# EAGLE design Udoo_Shield (EAGLE 7.5.0)
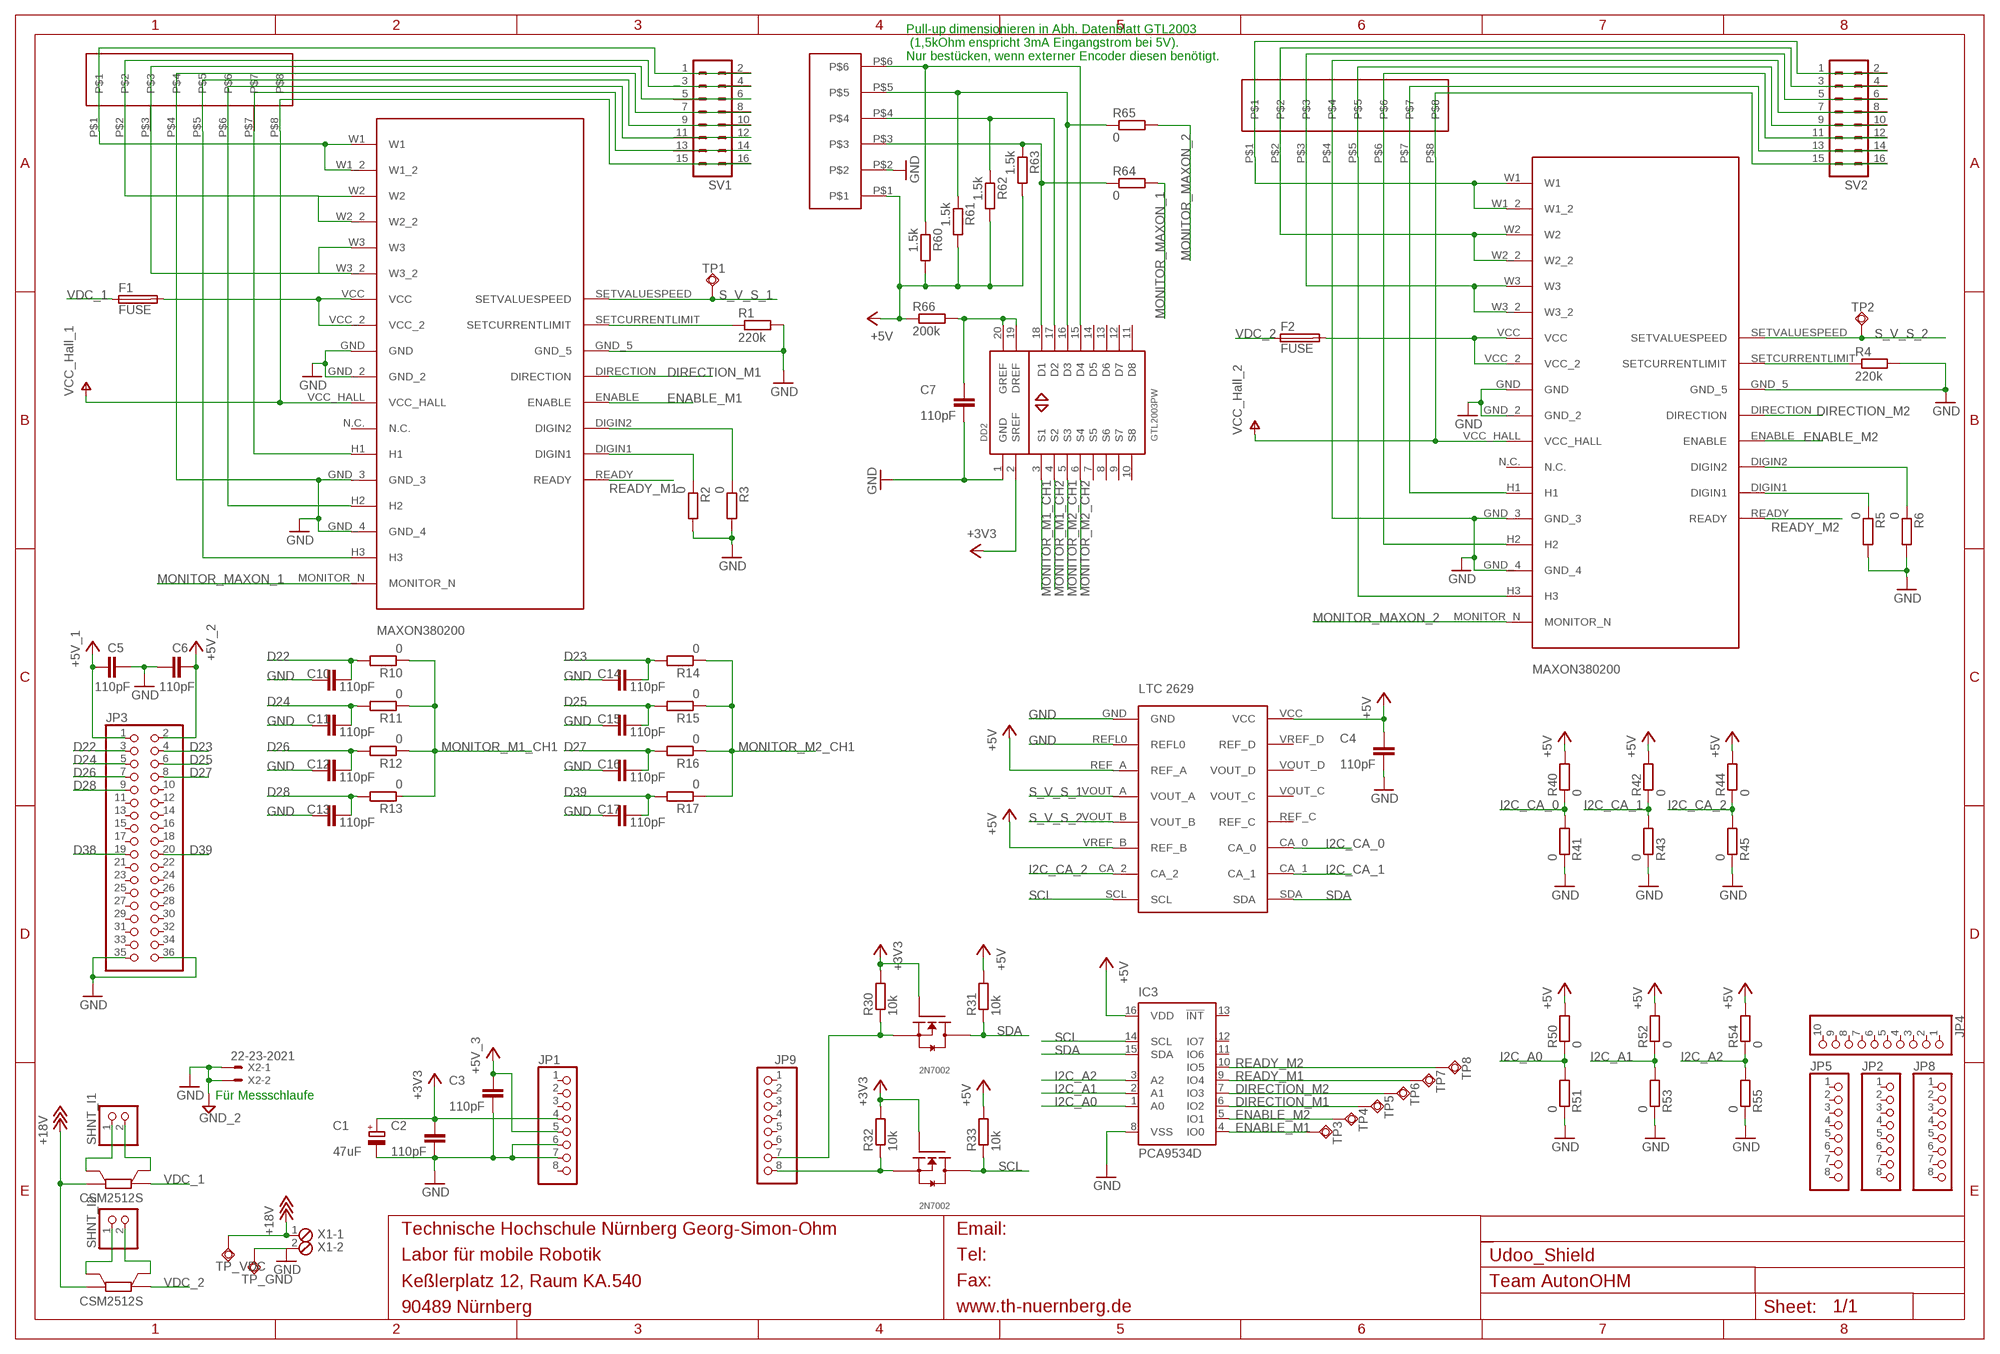
[diagram p0: schematic, sheet 1]

## Parts
C1  47uF  PANASONI_F_FP  [PANASONIC_F]
C2  110pF  C-EU0805  [SMD-0805]
C3  110pF  C-EU0805  [SMD-0805]
C4  110pF  C-EU0805  [SMD-0805]
C5  110pF  C-EU0805  [SMD-0805]
C6  110pF  C-EU0805  [SMD-0805]
C7  110pF  C-EU0805  [SMD-0805]
C10  110pF  C-EU0805  [SMD-0805]
C11  110pF  C-EU0805  [SMD-0805]
C12  110pF  C-EU0805  [SMD-0805]
C13  110pF  C-EU0805  [SMD-0805]
C14  110pF  C-EU0805  [SMD-0805]
C15  110pF  C-EU0805  [SMD-0805]
C16  110pF  C-EU0805  [SMD-0805]
C17  110pF  C-EU0805  [SMD-0805]
DD2  GTL2003PW  [TSSOP20]
ENCODER  WAGO_PICOMAX_35_6POLIG  [WAGO_PICOMAX_35_6POLIG]
F1  FUSE  [FUSE]
F2  FUSE  [FUSE]
FRAME1  A3L-LOC  [A3L-LOC]
IC3  PCA9534D  [SO16W]
JP1  PINHD-1X8  [1X08]
JP2  PINHD-1X8  [1X08]
JP3  PINHD-2X18  [2X18]
JP4  PINHD-1X10  [1X10]
JP5  PINHD-1X8  [1X08]
JP8  PINHD-1X8  [1X08]
JP9  PINHD-1X8  [1X08]
R1  220k  R-EU_M1206  [M1206]
R2  0  R-EU_M0805  [M0805]
R3  0  R-EU_M0805  [M0805]
R4  220k  R-EU_M1206  [M1206]
R5  0  R-EU_M0805  [M0805]
R6  0  R-EU_M0805  [M0805]
R10  0  R-EU_M0805  [M0805]
R11  0  R-EU_M0805  [M0805]
R12  0  R-EU_M0805  [M0805]
R13  0  R-EU_M0805  [M0805]
R14  0  R-EU_M0805  [M0805]
R15  0  R-EU_M0805  [M0805]
R16  0  R-EU_M0805  [M0805]
R17  0  R-EU_M0805  [M0805]
R30  10k  R-EU_M0805  [M0805]
R31  10k  R-EU_M0805  [M0805]
R32  10k  R-EU_M0805  [M0805]
R33  10k  R-EU_M0805  [M0805]
R40  0  R-EU_M0805  [M0805]
R41  0  R-EU_M0805  [M0805]
R42  0  R-EU_M0805  [M0805]
R43  0  R-EU_M0805  [M0805]
R44  0  R-EU_M0805  [M0805]
R45  0  R-EU_M0805  [M0805]
R50  0  R-EU_M0805  [M0805]
R51  0  R-EU_M0805  [M0805]
R52  0  R-EU_M0805  [M0805]
R53  0  R-EU_M0805  [M0805]
R54  0  R-EU_M0805  [M0805]
R55  0  R-EU_M0805  [M0805]
R60  1.5k  R-EU_M0805  [M0805]
R61  1.5k  R-EU_M0805  [M0805]
R62  1.5k  R-EU_M0805  [M0805]
R63  1.5k  R-EU_M0805  [M0805]
R64  0  R-EU_M0805  [M0805]
R65  0  R-EU_M0805  [M0805]
R66  200k  R-EU_M0805  [M0805]
SHNT_I1  PINHD-1X2  [1X02]
SHNT_I2  PINHD-1X2  [1X02]
SV1  MA08-2  [MA08-2]
SV2  MA08-2  [MA08-2]
TP1  TPSQB1,27  [B1,27]
TP2  TPSQB1,27  [B1,27]
TP3  TPSQB1,27  [B1,27]
TP4  TPSQB1,27  [B1,27]
TP5  TPSQB1,27  [B1,27]
TP6  TPSQB1,27  [B1,27]
TP7  TPSQB1,27  [B1,27]
TP8  TPSQB1,27  [B1,27]
TP_GND  TPSQB1,27  [B1,27]
TP_VDC  TPSQB1,27  [B1,27]
U$1  MAXON380200  [380200]
U$2  MAXON380200  [380200]
U$3  WAGO_PICOMAX_35_8POLIG  [WAGO_PICOMAX_35_8POLIG]
U$4  WAGO_PICOMAX_35_8POLIG  [WAGO_PICOMAX_35_8POLIG]
U$5  LTC2629  [LTC2629]
U$6  N-CH_MOSFET_2N7002  [2N7002]
U$10  CSM2512S  [CSM2512S]
U$14  CSM2512S  [CSM2512S]
U$15  N-CH_MOSFET_2N7002  [2N7002]
X1  MPT2  [2POL254]
X2  22-23-2021  [22-23-2021]

## Nets
+3V3: C1.+ C2.1 DD2.2(SREF) JP1.4 R30.2 R32.2 U$6.GATE(G) U$15.GATE(G)
+5V: C3.1 C4.1 C5.1 C6.2 ENCODER.P$1 IC3.16(VDD) JP1.5 JP3.1 JP3.2 R31.2 R33.2 R40.2 R42.2 R44.2 R50.2 R52.2 R54.2 R60.2 R61.2 R62.2 R63.2 R66.1 U$5.REF_A U$5.VCC U$5.VREF_B(REF_B) ; supply symbol labelled +5V_1, +5V_3, +5V_2
+18V: TP_VDC.TP U$10.I_2 U$14.I_2 X1.1
D1: JP9.8 R32.1 U$6.SOURCE(S)
D22: C10.2 JP3.3 R10.2
D23: C14.2 JP3.4 R14.2
D24: C11.2 JP3.5 R11.2
D25: C15.2 JP3.6 R15.2
D26: C12.2 JP3.7 R12.2
D27: C16.2 JP3.8 R16.2
D28: C13.2 JP3.9 R13.2
D34: JP9.7 R30.1 U$15.SOURCE(S)
D38: JP3.19
D39: C17.2 JP3.20 R17.2
DIRECTION_M1: IC3.6(IO2) TP5.TP U$1.DIRECTION
DIRECTION_M2: IC3.7(IO3) TP6.TP U$2.DIRECTION
ENABLE_M1: IC3.4(IO0) TP3.TP U$1.ENABLE
ENABLE_M2: IC3.5(IO1) TP4.TP U$2.ENABLE
GND: C1.- C2.2 C3.2 C4.2 C5.2 C6.1 C7.2 C10.1 C11.1 C12.1 C13.1 C14.1 C15.1 C16.1 C17.1 DD2.1(GND) ENCODER.P$2 IC3.8(VSS) JP1.6 JP1.7 JP3.35 JP3.36 R1.2 R2.2 R3.2 R4.2 R5.2 R6.2 R41.1 R43.1 R45.1 R51.1 R53.1 R55.1 SV1.7 SV1.8 SV2.7 SV2.8 TP_GND.TP U$1.GND U$1.GND_2 U$1.GND_3 U$1.GND_4 U$1.GND_5 U$2.GND U$2.GND_2 U$2.GND_3 U$2.GND_4 U$2.GND_5 U$3.P$4 U$4.P$4 U$5.GND U$5.REFL0 X1.2 X2.1 X2.2 ; supply symbol labelled GND_2
I2C_A0: IC3.1(A0) R50.1 R51.2
I2C_A1: IC3.2(A1) R52.1 R53.2
I2C_A2: IC3.3(A2) R54.1 R55.2
I2C_CA_0: R40.1 R41.2 U$5.CA_0
I2C_CA_1: R42.1 R43.2 U$5.CA_1
I2C_CA_2: R44.1 R45.2 U$5.CA_2
MONITOR_M1_CH1: DD2.3(S1) R10.1 R11.1 R12.1 R13.1
MONITOR_M1_CH2: DD2.4(S2)
MONITOR_M2_CH1: DD2.5(S3) R14.1 R15.1 R16.1 R17.1
MONITOR_M2_CH2: DD2.6(S4)
MONITOR_MAXON_1: R64.2 U$1.MONITOR_N
MONITOR_MAXON_2: R65.2 U$2.MONITOR_N
N$1: SV2.1 SV2.2 U$2.W1 U$2.W1_2 U$3.P$1
N$2: SV2.3 SV2.4 U$2.W2 U$2.W2_2 U$3.P$2
N$3: SV2.5 SV2.6 U$2.W3 U$2.W3_2 U$3.P$3
N$4: F1.P$2 U$1.VCC U$1.VCC_2
N$5: SHNT_I2.1 U$14.E_2
N$6: R1.1 U$1.SETCURRENTLIMIT
N$7: SV2.13 SV2.14 U$2.H1 U$3.P$7
N$8: SV1.13 SV1.14 U$1.H1 U$4.P$7
N$9: SV2.11 SV2.12 U$2.H2 U$3.P$6
N$10: SV2.9 SV2.10 U$2.H3 U$3.P$5
N$12: F2.P$2 U$2.VCC U$2.VCC_2
N$13: R4.1 U$2.SETCURRENTLIMIT
N$15: SV1.11 SV1.12 U$1.H2 U$4.P$6
N$16: SV1.9 SV1.10 U$1.H3 U$4.P$5
N$17: SV1.1 SV1.2 U$1.W1 U$1.W1_2 U$4.P$1
N$18: SHNT_I1.1 U$10.E_2
N$19: SHNT_I1.2 U$10.E_1
N$20: SHNT_I2.2 U$14.E_1
N$22: C7.1 DD2.19(DREF) DD2.20(GREF) R66.2
N$23: DD2.18(D1) ENCODER.P$3 R63.1 R64.1
N$24: DD2.17(D2) ENCODER.P$4 R62.1
N$25: DD2.16(D3) ENCODER.P$5 R61.1 R65.1
N$31: R5.1 U$2.DIGIN1
N$32: DD2.15(D4) ENCODER.P$6 R60.1
N$33: SV1.5 SV1.6 U$1.W3 U$1.W3_2 U$4.P$3
N$34: R6.1 U$2.DIGIN2
N$36: SV1.3 SV1.4 U$1.W2 U$1.W2_2 U$4.P$2
N$38: R2.1 U$1.DIGIN1
N$39: R3.1 U$1.DIGIN2
READY_M1: IC3.9(IO4) TP7.TP U$1.READY
READY_M2: IC3.10(IO5) TP8.TP U$2.READY
S_V_S_1: TP1.TP U$1.SETVALUESPEED U$5.VOUT_A
S_V_S_2: TP2.TP U$2.SETVALUESPEED U$5.VOUT_B
SCL: IC3.14(SCL) R33.1 U$5.SCL U$6.DRAIN(D)
SDA: IC3.15(SDA) R31.1 U$5.SDA U$15.DRAIN(D)
V_HALL_1: SV1.15 SV1.16 U$1.VCC_HALL U$4.P$8 ; supply symbol labelled VCC_Hall_1
V_HALL_2: SV2.15 SV2.16 U$2.VCC_HALL U$3.P$8 ; supply symbol labelled VCC_Hall_2
VDC_1: F1.P$1 U$10.I_1
VDC_2: F2.P$1 U$14.I_1
Unconnected: DD2.7(S5) DD2.8(S6) DD2.9(S7) DD2.10(S8) DD2.11(D8) DD2.12(D7) DD2.13(D6) DD2.14(D5) IC3.11(IO6) IC3.12(IO7) IC3.13(!INT) JP1.1 JP1.2 JP1.3 JP1.8 JP2.1 JP2.2 JP2.3 JP2.4 JP2.5 JP2.6 JP2.7 JP2.8 JP3.10 JP3.11 JP3.12 JP3.13 JP3.14 JP3.15 JP3.16 JP3.17 JP3.18 JP3.21 JP3.22 JP3.23 JP3.24 JP3.25 JP3.26 JP3.27 JP3.28 JP3.29 JP3.30 JP3.31 JP3.32 JP3.33 JP3.34 JP4.1 JP4.2 JP4.3 JP4.4 JP4.5 JP4.6 JP4.7 JP4.8 JP4.9 JP4.10 JP5.1 JP5.2 JP5.3 JP5.4 JP5.5 JP5.6 JP5.7 JP5.8 JP8.1 JP8.2 JP8.3 JP8.4 JP8.5 JP8.6 JP8.7 JP8.8 JP9.1 JP9.2 JP9.3 JP9.4 JP9.5 JP9.6 U$1.N.C. U$2.N.C. U$5.REF_C U$5.VOUT_C U$5.VOUT_D U$5.VREF_D(REF_D)

## Notes on the sheet
- Pull-up dimensionieren in Abh. Datenblatt GTL2003
   (1,5kOhm enspricht 3mA Eingangstrom bei 5V).
  Nur bestücken, wenn externer Encoder diesen benötigt.
- Für Messschlaufe

## Library data of the parts
C1 = Electrolytic Capacitors FP:PANASONI_F_FP
C2-C7 C10-C17 = robotic - Kondenstatoren:C-EU: CAPACITOR, European symbol
DD2 = gtl2003:GTL2003: 8-bit bidirectional low voltage translator
ENCODER = robotic - Stecker:WAGO_PICOMAX_35_6POLIG
F1 F2 = fuse:FUSE
FRAME1 = robotic - Rahmen:A3L-LOC: RAHMEN Labor für mobile Robotik Rahmen fuer Schaltplan; AUTHOR: Team AutonOHM; EMAIL: stefan.may@th-nuernberg.de; PROJECT_NAME: MaxonShield; VERSION: Version 2.0
IC3 = micro-philips:PCA9534: 8-bit I2C-bus and SMBus low power I/O port with interrupt Source: www.nxp.com .. PCA9534_3.pdf; MPN: PCA9534DB; OC_FARNELL: 1408284; OC_NEWARK: 18M7513
JP1 JP2 JP5 JP8 JP9 = pinhead:PINHD-1X8: PIN HEADER
JP3 = pinhead:PINHD-2X18: PIN HEADER
JP4 = pinhead:PINHD-1X10: PIN HEADER
R1-R6 R10-R17 R30-R33 R40-R45 R50-R55 R60-R66 = resistor:R-EU_: RESISTOR, European symbol
SHNT_I1 SHNT_I2 = pinhead:PINHD-1X2: PIN HEADER
SV1 SV2 = robotic - Stiftleisten:MA08-2: PIN HEADER
TP1-TP8 TP_GND TP_VDC = testpad:TPSQ: Test pad
U$1 U$2 = Maxon:MAXON380200
U$3 U$4 = robotic - Stecker:WAGO_PICOMAX_35_8POLIG
U$5 = Digital Analog Converter:LTC2629
U$6 U$15 = Transistor:N-CH_MOSFET_2N7002
U$10 U$14 = Shunt:CSM2512S
X1 = con-phoenix-254:MPT2: PHOENIX CONNECTOR; OC_FARNELL: unknown; OC_NEWARK: unknown
X2 = con-molex:22-23-2021: .100" (2.54mm) Center Header - 2 Pin; MF: MOLEX; MPN: 22-23-2021; OC_FARNELL: 1462926; OC_NEWARK: 25C3832

## Board
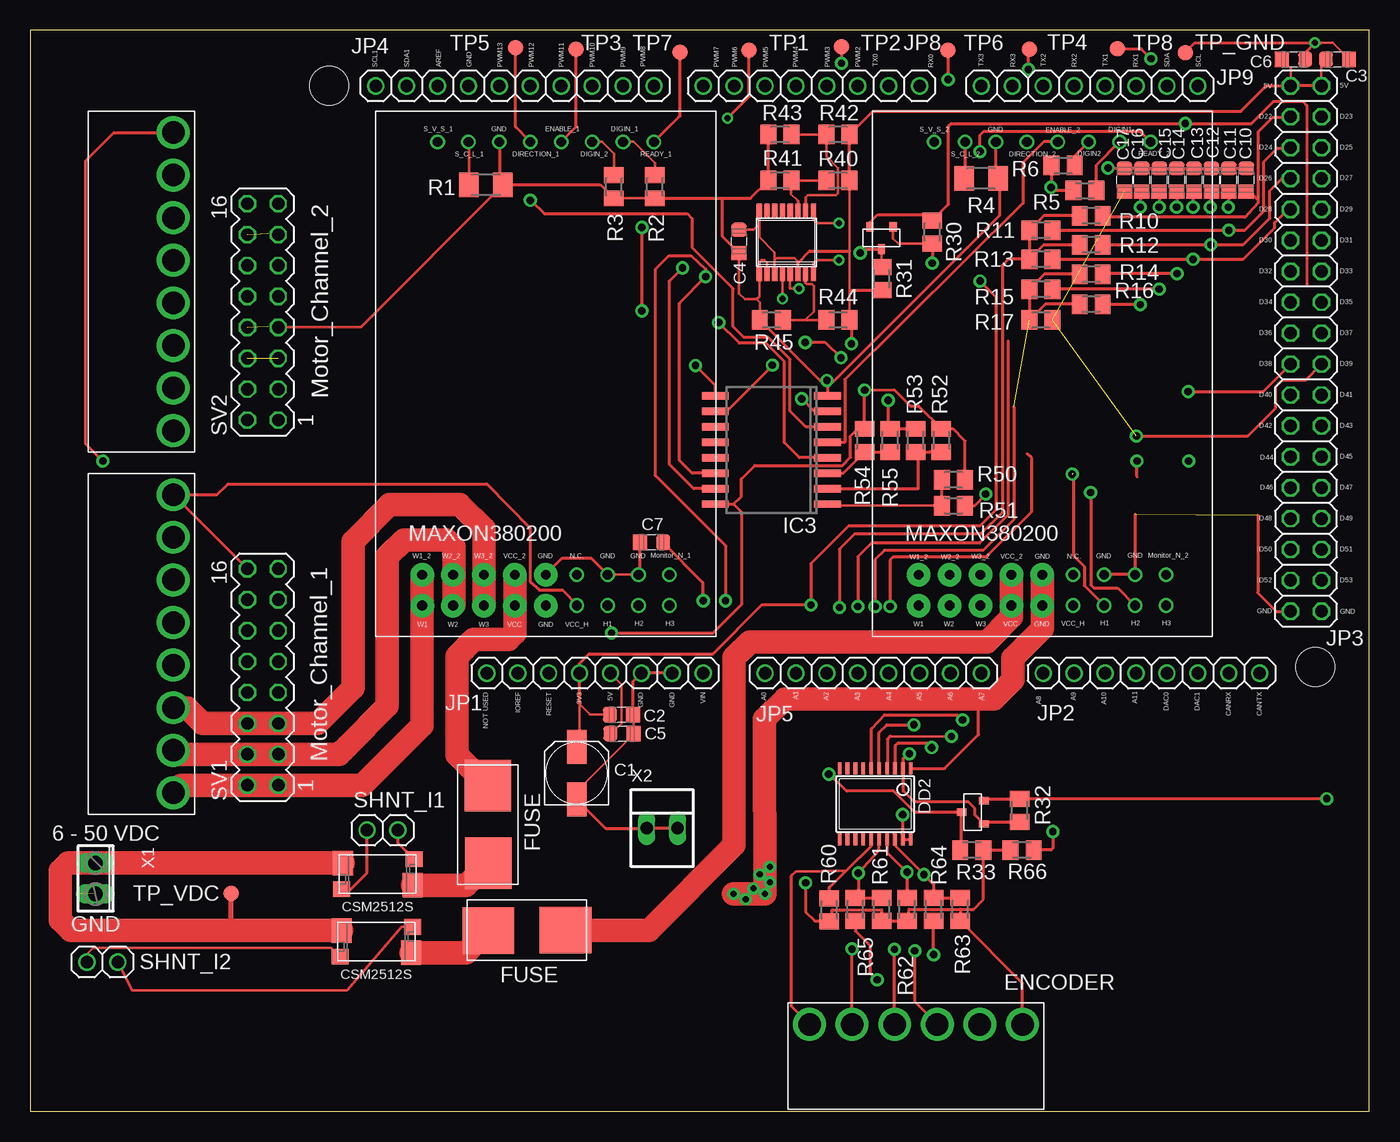
[diagram p1: board, top side]
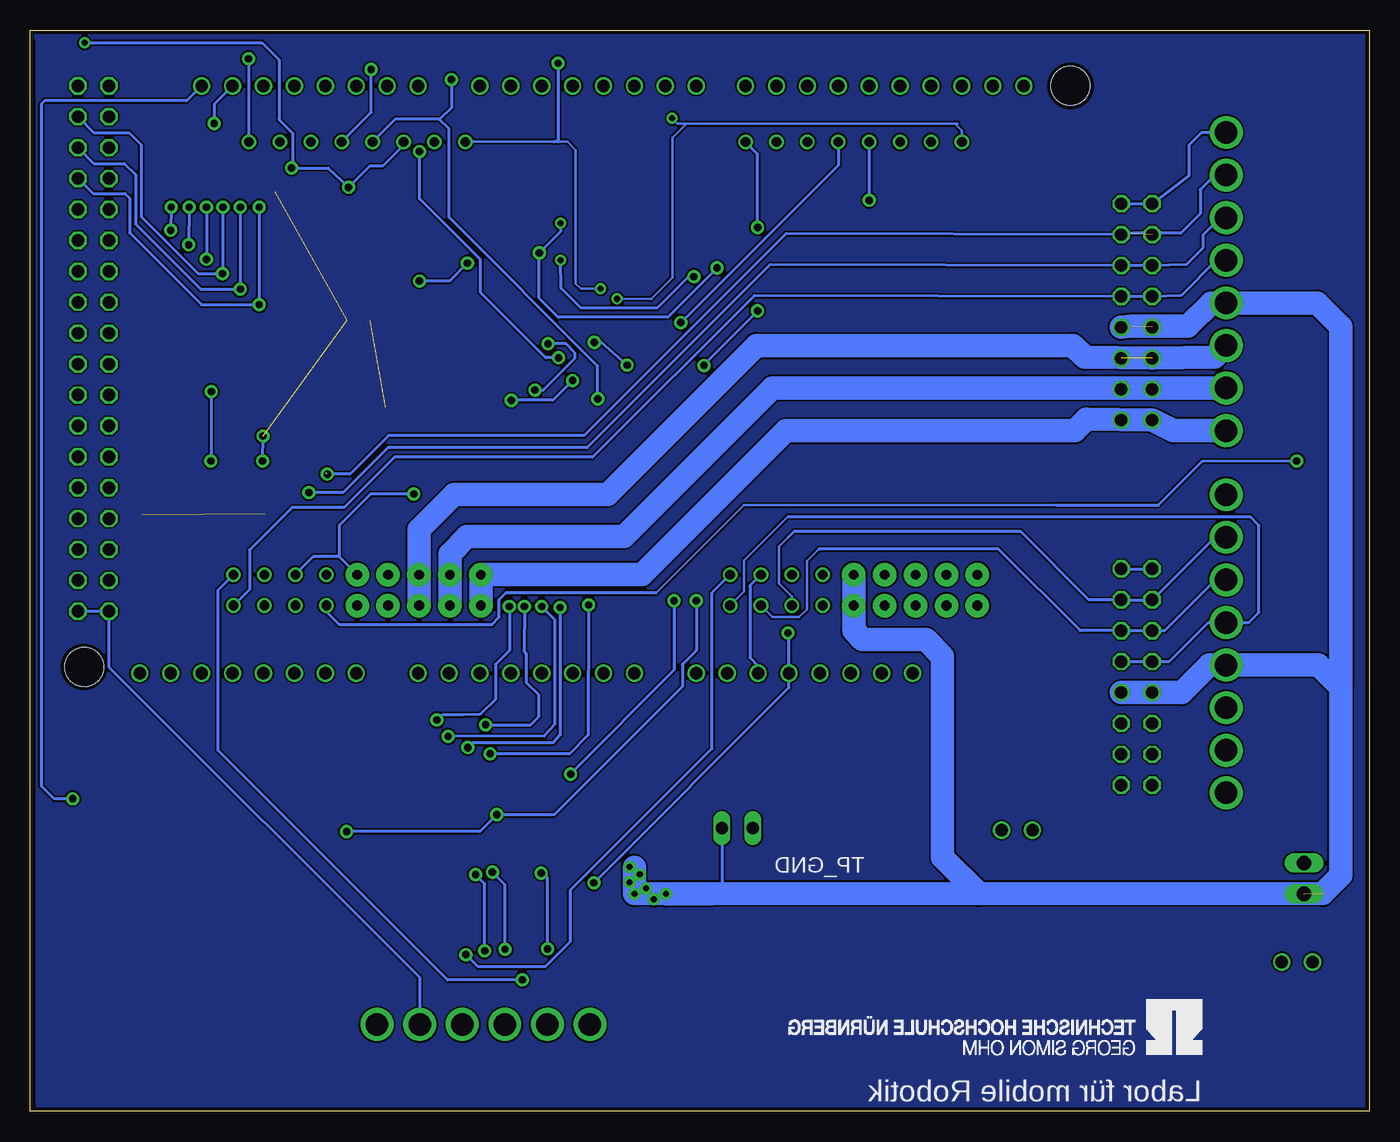
[diagram p2: board, bottom side, seen from below]

Size 109.99 x 88.8 mm. Coordinates in mm from the lower left corner, seen from the top.
Outline: 0,0 109.99,0 109.99,88.8 0,88.8 0,0
Copper layers (1*16): Top 0.035mm / dielectric 1.5mm / Bottom 0.035mm
Design rules "PCB-POOL Standard": minimum track width 0.15mm, minimum drill 0.3mm, track to track 0.15mm, track to pad 0.15mm, pad to pad 0.15mm, via to via 0.15mm, smd to smd 0.15mm, copper to edge 0.3mm, drill to drill 0.2mm, minimum pad ring 0.2mm, minimum via ring 0.15mm, stop-mask expansion 0.075mm, vias tented up to drill 0mil, thermal gap 0.2mm
Holes 3.2 mm at 24.53,84.25 105.58,36.49

### Footprints (pad centres in the part's own frame; a part is rotated, then mirrored left to right if it is on the bottom)
PANASONIC_F = smd 1.6 x 2.8: + 0,-2.143; - 0,2.143
SMD-0805 = smd 1.143 x 1.27: 1 -0.953,0; 2 0.953,0
TSSOP20 = smd 0.305 x 0.991: 1 -2.925,-2.918; 2 -2.275,-2.918; 3 -1.625,-2.918; 4 -0.975,-2.918; 5 -0.325,-2.918; 6 0.325,-2.918; 7 0.975,-2.918; 8 1.625,-2.918; 9 2.275,-2.918; 10 2.925,-2.918; 11 2.925,2.918; 12 2.275,2.918; 13 1.625,2.918; 14 0.975,2.918; 15 0.325,2.918; 16 -0.325,2.918; 17 -0.975,2.918; 18 -1.625,2.918; 19 -2.275,2.918; 20 -2.925,2.918
WAGO_PICOMAX_35_6POLIG = drill 1.85 pad 2.7: P$1 -22.38,1.75; P$2 -18.88,1.75; P$3 -15.38,1.75; P$4 -11.88,1.75; P$5 -8.38,1.75; P$6 -4.88,1.75
FUSE = smd 4.24 x 3.81: P$1 -3.175,-0.04; P$2 3.175,0
SO16W = smd 0.6 x 2.2: 1 -4.445,-4.6; 2 -3.175,-4.6; 3 -1.905,-4.6; 4 -0.635,-4.6; 5 0.635,-4.6; 6 1.905,-4.6; 7 3.175,-4.6; 8 4.445,-4.6; 9 4.445,4.6; 10 3.175,4.6; 11 1.905,4.6; 12 0.635,4.6; 13 -0.635,4.6; 14 -1.905,4.6; 15 -3.175,4.6; 16 -4.445,4.6
1X08 = drill 1.016: 1 -8.89,0; 2 -6.35,0; 3 -3.81,0; 4 -1.27,0; 5 1.27,0; 6 3.81,0; 7 6.35,0; 8 8.89,0
2X18 = drill 1.016 octagon: 1 -21.59,-1.27; 2 -21.59,1.27; 3 -19.05,-1.27; 4 -19.05,1.27; 5 -16.51,-1.27; 6 -16.51,1.27; 7 -13.97,-1.27; 8 -13.97,1.27; 9 -11.43,-1.27; 10 -11.43,1.27; 11 -8.89,-1.27; 12 -8.89,1.27; 13 -6.35,-1.27; 14 -6.35,1.27; 15 -3.81,-1.27; 16 -3.81,1.27; 17 -1.27,-1.27; 18 -1.27,1.27; 19 1.27,-1.27; 20 1.27,1.27; 21 3.81,-1.27; 22 3.81,1.27; 23 6.35,-1.27; 24 6.35,1.27; 25 8.89,-1.27; 26 8.89,1.27; 27 11.43,-1.27; 28 11.43,1.27; 29 13.97,-1.27; 30 13.97,1.27; 31 16.51,-1.27; 32 16.51,1.27; 33 19.05,-1.27; 34 19.05,1.27; 35 21.59,-1.27; 36 21.59,1.27
1X10 = drill 1.016: 1 -11.43,0; 2 -8.89,0; 3 -6.35,0; 4 -3.81,0; 5 -1.27,0; 6 1.27,0; 7 3.81,0; 8 6.35,0; 9 8.89,0; 10 11.43,0
M1206 = smd 1.6 x 2: 1 -1.4,0; 2 1.4,0
M0805 = smd 1.3 x 1.6: 1 -0.95,0; 2 0.95,0
1X02 = drill 1.016: 1 -1.27,0; 2 1.27,0
MA08-2 = drill 1.016 octagon: 1 -8.89,-1.27; 2 -8.89,1.27; 3 -6.35,-1.27; 4 -6.35,1.27; 5 -3.81,-1.27; 6 -3.81,1.27; 7 -1.27,-1.27; 8 -1.27,1.27; 9 1.27,-1.27; 10 1.27,1.27; 11 3.81,-1.27; 12 3.81,1.27; 13 6.35,-1.27; 14 6.35,1.27; 15 8.89,-1.27; 16 8.89,1.27
B1,27 = smd 1.27 x 1.27: TP 0,0
380200 = drill 0.8: DIGIN1 -6.35,-19.05; DIGIN2 -3.81,-19.05; DIRECTION 1.27,-19.05; ENABLE -1.27,-19.05; GND_3 -5.08,16.51; GND_4 -7.62,16.51; GND_5 3.81,-19.05; H1 -5.08,19.05; H2 -7.62,19.05; H3 -10.16,19.05; MONITOR_N -10.16,16.51; N.C. -2.54,16.51; READY -8.89,-19.05; SETCURRENTLIMIT 6.35,-19.05; SETVALUESPEED 8.89,-19.05; VCC_HALL -2.54,19.05 | drill 0.8 pad 1.93: GND 0,19.05; GND_2 0,16.51; VCC 2.54,19.05; VCC_2 2.54,16.51; W1 10.16,19.05; W1_2 10.16,16.51; W2 7.62,19.05; W2_2 7.62,16.51; W3 5.08,19.05; W3_2 5.08,16.51
WAGO_PICOMAX_35_8POLIG = drill 1.85 pad 2.7: P$1 1.75,1.75; P$2 5.25,1.75; P$3 8.75,1.75; P$4 12.25,1.75; P$5 15.75,1.75; P$6 19.25,1.75; P$7 22.75,1.75; P$8 26.25,1.75
LTC2629 = smd 0.42 x 1.143: CA_0 0.953,2.619; CA_1 1.587,2.619; CA_2 1.587,-2.619; GND -2.223,-2.619; REF_A -0.953,-2.619; REF_C 0.318,2.619; REFL0 -1.587,-2.619; SCL 2.223,-2.619; SDA 2.223,2.619; VCC -2.223,2.619; VOUT_A -0.318,-2.619; VOUT_B 0.318,-2.619; VOUT_C -0.318,2.619; VOUT_D -0.953,2.619; VREF_B 0.953,-2.619; VREF_D -1.587,2.619
2N7002 = smd 0.6 x 0.8: DRAIN 0,0.913; GATE -0.953,-0.913; SOURCE 0.953,-0.913
CSM2512S = smd 1.3 x 1.39: E_1 -1.23,2.977; E_2 1.23,-2.977 | smd 2.01 x 1.65: I_1 0.913,2.857; I_2 -0.913,-2.857
2POL254 = drill 1.2 long: 1 -1.27,0; 2 1.27,0
22-23-2021 = drill 1 long: 1 -1.27,0; 2 1.27,0

### Placement (x,y rotation side)
C1  44.88,27.77 180 top
C2  48.57,32.57 0 top
C3  107.39,86.43 0 top
C4  58.22,71.47 270 top
C5  48.61,31.03 0 top
C6  103.78,86.43 180 top
C7  51.03,46.74 180 top
C10  99.89,76.51 270 top
C11  98.46,76.51 270 top
C12  97.03,76.51 270 top
C13  95.6,76.51 270 top
C14  94.17,76.51 270 top
C15  92.75,76.51 270 top
C16  91.32,76.51 270 top
C17  89.89,76.51 270 top
DD2  69.41,25.23 180 top
ENCODER  59.13,8.88 180 top
F1  37.58,23.56 90 top
F2  40.8,14.87 0 top
FRAME1  70.02,-27.79 0 bottom  (outside the outline)
IC3  60.88,54.32 90 top
JP1  46.39,35.99 0 top
JP2  92.11,35.99 0 top
JP3  104.81,62.66 270 top
JP4  39.8,84.25 0 top
JP5  69.25,35.99 0 top
JP8  64.17,84.25 0 top
JP9  87.03,84.25 0 top
R1  37.42,76.11 0 top
R2  51.31,75.95 270 top
R3  47.94,75.95 270 top
R4  78.1,76.63 0 top
R5  86.63,75.63 180 top
R6  84.85,77.7 180 top
R10  87.15,73.57 0 top
R11  83.02,72.38 0 top
R12  87.15,71.19 0 top
R13  83.02,70 0 top
R14  87.15,68.77 0 top
R15  83.02,67.54 0 top
R16  87.15,66.31 0 top
R17  83.02,65 0 top
R30  74.09,72.22 270 top
R31  69.93,68.41 270 top
R32  81.28,24.71 270 top
R33  77.35,21.46 0 top
R40  66.35,76.47 0 top
R41  61.59,76.47 0 top
R42  66.35,80.24 0 top
R43  61.59,80.24 0 top
R44  66.35,65 0 top
R45  60.88,65 0 top
R50  75.84,51.86 0 top
R51  75.84,49.76 180 top
R52  74.85,55.12 90 top
R53  72.74,55.12 270 top
R54  68.54,55.12 90 top
R55  70.64,55.12 270 top
R60  65.64,16.54 270 top
R61  69.93,16.58 270 top
R62  72.03,16.58 270 top
R63  76.39,16.58 270 top
R64  74.21,16.58 270 top
R65  67.78,16.58 270 top
R66  81.47,21.46 0 top
SHNT_I1  28.93,23.09 0 top
SHNT_I2  5.91,12.25 0 top
SV1  19.09,35.67 90 top
SV2  19.09,65.67 90 top
TP1  59.05,87.18 0 top
TP2  66.63,87.46 0 top
TP3  44.84,87.26 0 top
TP4  82.07,87.26 0 top
TP5  39.84,87.38 0 top
TP6  75.4,87.18 0 top
TP7  53.38,87.02 0 top
TP8  89.29,87.3 0 top
TP_GND  94.89,86.98 0 top
TP_VDC  16.51,17.89 0 top
U$1  42.34,60.59 180 top
U$2  83.14,60.59 180 top
U$3  13.49,54.16 90 top
U$4  13.49,24.4 90 top
U$5  62.11,71.39 0 top
U$6  77.43,24.56 90 top
U$10  28.53,19.48 270 top
U$14  28.41,13.92 270 top
U$15  69.93,71.74 180 top
X1  5.35,19.12 270 top
X2  51.91,23.25 0 top

### Tracks (layer width: path | path; a pad name or v marks a point on that pad's centre or on a via)
+3V3  (via drill 0.6)
  Top 0.203: C2.1 45.99,32.57 45.12,33.45 45.12,30.15 C1.+ | U$15.GATE 70.88,71.7 71.31,71.27 R30.2
  Top 0.254: R32.2 78.5,23.77 U$6.GATE 77.58,24.36 77.58,24.87 77.07,25.39 72.62,25.39 71.71,26.3 71.71,28.12 DD2.2 71.69,28.97 v72.23,29.36 | R30.2 v74.09,69.68 | v78.02,68.21 79.33,66.9 79.33,49.4 78.02,48.09 67.23,48.09 64.13,45 v64.13,41.58 64.09,41.62 60.12,41.62 56.08,37.57 45.91,37.57 45.12,36.78 JP1.4 45.12,33.45
  Bottom 0.254: v64.13,41.58 64.17,30.91 65.68,29.36 v72.23,29.36 | v74.09,69.68 75.56,68.21 v78.02,68.21
+5V  (via drill 0.6)
  Top 0.203: U$5.VREF_B 63.06,69.8 62.78,70.08 61.35,70.08 61.16,69.88 | 61.16,69.88 U$5.REF_A | 67.31,66.58 67.3,66.59 67.3,67.02 | 67.31,66.58 R44.2 | U$5.VCC 59.89,72.89 | 59.89,72.89 59.89,71.82 61.16,70.55 61.16,69.88 | R40.2 67.31,70.67 67.31,67.42 67.31,66.58 | C5.1 47.66,30.95 48.57,31.86 48.57,35.07 JP1.5 | C3.1 106.08,86.07 JP3.2 | C6.2 103.54,85.71 JP3.1 | C4.1 59.41,72.42 59.89,72.89
  Top 0.254: R40.2 R42.2 69.21,82.14 99.45,82.14 101.56,84.25 JP3.1 JP3.2 | R44.2 67.47,64.84 v67.47,63.05 | 56.2,49.8 IC3.16 57.78,49.88 | R50.2 76.79,55.08 75.8,56.06 R52.2 72.98,57.93 72.31,57.93 70.96,59.28 v68.54,59.24 R54.2 67.98,56.06 67.39,55.47 67.39,53.73 66.71,53.05 59.53,53.05 58.42,51.94 58.42,50.51 57.78,49.88 | 76.39,16.58 72.19,16.58 72.19,15.79 R62.2 R61.2 69.93,16.55 65.88,16.55 65.88,15.83 R60.2 65.6,15.63 64.45,15.63 63.7,16.38 v63.7,18.76 | 76.39,16.58 R63.2 81.51,10.51 ENCODER.P$1 | R66.1 R33.2 78.3,17.41 77.51,16.58 76.39,16.58 | U$5.VREF_B 63.06,69.68 64.01,70.67 67.31,70.67 | R31.2 69.88,67.42 67.31,67.42 | v47.74,39.28 56.08,39.28 58.46,41.66 58.46,49.2 57.78,49.88
  Bottom 0.254: v63.7,18.76 47.66,34.8 JP1.5 47.66,39.2 v47.74,39.28 | v68.54,59.24 67.86,59.24 65.24,61.86 65.24,62.3 66,63.05 v67.47,63.05
+18V
  Top 0.254: U$14.I_2 25.55,14.91
  Top 0.406: TP_VDC.TP 16.47,17.89 16.47,14.83
  Top 1.93: U$10.I_2 X1.1 3.09,20.39 2.46,19.75 2.46,15.71 3.33,14.83 16.47,14.83 U$14.I_2
D1  (via drill 0.6)
  Top 0.254: U$6.SOURCE 78.5,25.66 R32.1 82.95,25.66 v106.52,25.67
  Bottom 0.254: JP9.8 97.15,83.02 108.82,83.02 109.1,82.74 109.1,26.74 108.03,25.67 v106.52,25.67
D22
  Top 0.254: 103.54,81.67 JP3.3 103.5,81.67 102.07,81.67 100.88,80.48 100.88,74.84 | 99.85,75.52 C10.2 100.17,75.55 100.88,74.84 | 100.88,74.84 100.88,74.64 99.81,73.45 88.22,73.45 R10.2
D23  (via drill 0.6)
  Top 0.254: C14.2 94.21,75.47 v94.17,74.28 | v94.21,68.81 88.1,68.81 R14.2
  Bottom 0.254: JP3.4 104.77,80.4 101.87,80.4 100.88,79.4 100.88,73.49 96.2,68.81 v94.21,68.81 v94.17,74.28
D24  (via drill 0.6)
  Top 0.254: R11.2 v98.46,72.38 99.77,72.38 101.36,73.97 101.36,78.02 102.47,79.13 103.5,79.13 JP3.5 103.54,79.13 | C11.2 v98.42,74.28
  Bottom 0.254: v98.42,74.28 v98.46,72.38
D25  (via drill 0.6)
  Top 0.254: C15.2 v92.75,74.28 | v92.75,67.54 R15.2
  Bottom 0.254: JP3.6 104.77,77.86 102.27,77.86 101.36,76.94 101.36,72.89 96,67.54 v92.75,67.54 v92.75,74.28
D26  (via drill 0.6)
  Top 0.254: R12.2 v96.99,71.19 99.65,71.19 101.83,73.37 101.83,75.63 102.79,76.59 103.5,76.59 JP3.7 103.54,76.51 | C12.2 96.99,75.52 v96.95,74.28
  Bottom 0.254: v96.95,74.28 v96.99,71.19
D27  (via drill 0.6)
  Top 0.254: C16.2 91.2,75.52 v91.2,74.28 | v91.2,66.27 88.1,66.27 R16.2
  Bottom 0.254: JP3.8 104.85,75.4 102.23,75.4 101.83,75 101.83,72.18 95.92,66.27 v91.2,66.27 v91.2,74.28
D28  (via drill 0.6)
  Top 0.254: R13.2 v95.52,70 99.65,70 102.23,72.58 102.23,73.01 103.3,74.09 JP3.9 103.54,74.2 | C13.2 95.52,75.52 v95.52,74.28
  Bottom 0.254: v95.52,74.28 v95.52,70
D34  (via drill 0.6)
  Top 0.254: 104.89,67.81 104.89,82.62 104.53,82.98 102.15,82.98 100.33,81.15 v94.89,81.15 75.68,81.15 75.44,80.91 75.44,74.52 R30.1 73.61,73.65 69.61,73.65 68.97,73.01 U$15.SOURCE
  Bottom 0.254: JP9.7 94.89,82.74 v94.89,81.15
D38  (via drill 0.6)
  Top 0.254: v95.13,59.12 101.28,59.12 JP3.19
  Bottom 0.254: v95.13,59.12 95.13,53.45 v95.17,53.41
D39  (via drill 0.6)  (2 unrouted)
  Top 0.254: 90.92,52.14 v90.92,53.41 | JP3.20 104.77,60.08 102.87,60.08 102.31,59.52 102.31,57.77 100.01,55.47 v90.88,55.47
  Bottom 0.254: v90.92,53.41 v90.88,55.47
DIRECTION_M1  (via drill 0.6)
  Top 0.254: U$1.DIRECTION 39.84,80.87 TP5.TP | IC3.6 63.73,56.23 62.43,57.54 62.43,61.78 60.6,63.61 58.58,63.61 57.74,64.44 57.74,67.58 54.37,70.95 54.37,73.33 53.97,73.73 42.22,73.73 41.11,74.84 v41.07,74.84
  Bottom 0.254: v41.07,74.84 U$1.DIRECTION | U$1.DIRECTION
DIRECTION_M2  (via drill 0.6)
  Top 0.254: TP6.TP v75.4,84.76 | IC3.7 64.41,57.5 v63.38,58.53
  Bottom 0.254: v75.4,84.76 75.4,82.46 76.36,81.51 76.39,81.51 | 76.39,81.51 80.01,81.51 U$2.DIRECTION | v63.38,58.53 63.38,61.23 75.6,73.45 75.6,80.71 76.39,81.51
ENABLE_M1  (via drill 0.6)
  Top 0.254: IC3.4 63.18,53.69 61.95,54.92 61.95,61.58 60.44,63.09 58.26,63.09 v56.55,64.8 | U$1.ENABLE 44.84,80.87 TP3.TP
  Bottom 0.254: v56.55,64.8 43.61,77.74 U$1.ENABLE
ENABLE_M2  (via drill 0.6)
  Top 0.254: U$2.ENABLE 83.26,79.64 81.55,77.94 81.55,74.6 66.91,60.12 66.91,54.96 IC3.5 | v81.99,85.59 81.99,87.26 TP4.TP
  Bottom 0.254: U$2.ENABLE 81.99,82.06 v81.99,85.59
GND  (via drill 0.5, 0.5 pad 1.02, 0.6)  (3 unrouted)
  Top 0.203: U$1.GND_3 U$1.GND_4 | 60.64,76.51 R41.1 | 59.65,66.7 58.69,66.7 58.22,67.18 C4.2 58.22,69.92 | 59.65,66.7 59.89,66.94 U$5.GND 59.89,69.72 60.08,69.92 60.32,69.92 60.52,69.72 U$5.REFL0 | R45.1 59.93,66.42 59.65,66.7 | 79.33,76.8 R4.2 | C2.2 49.57,32.73 C5.2 49.57,30.95 44.88,26.26 C1.- | C3.2 106.99,87.78 106.04,87.78 v105.52,87.78 | R3.2 R2.2 | U$1.GND_5
  Top 0.254: C10.1 C11.1 C12.1 C13.1 C14.1 C15.1 | C15.1 91.99,77.46 | C16.1 90.44,77.46 | 90.44,77.46 C17.1 89.89,77.5 v88.54,77.5 | 79.33,76.8 U$2.GND_5 | R6.2 83.9,75.95 v83.86,75.91 84.13,75.63 R5.2 | 90.44,77.46 90.52,77.54 91.91,77.54 91.99,77.46 | R2.2 56.87,75 | 56.87,75 59.18,75 R41.1 | 60.64,76.51 R43.1 | R1.2 46.83,76.11 R3.2 | C4.2 56.87,71.86 56.87,75 | R53.1 R55.1 70.48,56.22 v70.48,58.41 | 65.48,60 v65.44,60.04 64.89,60.04 R45.1 | JP1.7 JP1.6 49.53,35.31 C2.2 | 100.84,48.96 100.84,42.57 102.35,41.07 JP3.35 | 90.76,49.04 U$2.GND_4 U$2.GND_3 | U$1.GND_4 50.08,44.2 C7.2 | 65.48,60 66.04,60 79.65,73.61 79.65,76.48 R4.2 | 65.48,60 IC3.8 | v105.52,87.78 104.73,86.98 C6.1 | TP_GND.TP 95.68,87.78 106.04,87.78 | C1.- 47.26,23.25 X2.1 X2.2 | R51.1 77.58,49.76 v78.5,50.71 | U$1.GND_2 43.69,45.43 46.07,45.43 U$1.GND_3 | U$1.GND_5 38.53,76.4 R1.2 | SV2.7 27.19,64.48 R1.2 | DD2.1 75.11,28.15 77.9,30.95 77.9,33.68 78.1,33.88 | 91.99,77.46 C16.1 | C16.1 C15.1
  Top 0.406: v57.78,17.85 58.77,17.85 v58.77,17.41 | v59.41,18.29 60.36,18.29 | 60.36,18.29 v60.36,17.85 | 60.36,18.29 60.76,18.29 v60.76,18.8 | v59.92,19.44 60.76,19.44 v60.76,20.07 60.35,20.07 60.35,20.11
  Top 1.93: U$2.GND_2 U$2.GND 83.14,39.64 80.72,37.22 80.72,35.43 79.17,33.88 78.1,33.88 61.99,33.88 60.32,32.22 60.32,29.04 60.35,20.11 v60.36,17.85 v57.78,17.85
  Bottom 0.254: U$2.GND_5 79.33,79.36 81.04,77.66 82.11,77.66 v83.86,75.91 85.52,77.5 v88.54,77.5 88.46,77.7 88.46,80.36 89.57,81.47 89.57,86.39 90.96,87.78 v105.52,87.78 | v65.44,60.04 67.07,58.41 v70.48,58.41 | U$1.GND_4 50.88,43.17 50.88,37.26 50.2,36.58 JP1.6 | U$2.GND_2 84.61,45.55 | 84.61,45.55 86.75,45.55 U$2.GND_3 | ENCODER.P$2 78.01,10.97 103.54,36.5 JP3.35 JP3.36 | 84.61,45.55 84.61,48.13 82.03,50.71 v78.5,50.71 | 58.06,18.37 v57.78,17.85 | X2.2 53.18,18.76 54.09,17.85
  Bottom 0.406: U$2.GND
  Bottom 1.93: U$1.GND_2 U$1.GND 42.34,39.48 41.63,38.76 36.43,38.76 35.04,37.38 35.04,20.87 32.06,17.89 | 2.34,34.8 2.34,19.36 3.81,17.89 54.09,17.85 v57.78,17.85 60.36,17.89 60.36,20.03 | 2.34,34.8 4.19,36.65 U$4.P$4 13.15,36.65 15.39,34.4 SV1.8 SV1.7 | 2.34,34.8 2.34,64.48 4.27,66.41 U$3.P$4 12.97,66.41 14.88,64.5 19.54,64.5 SV2.7
GND_2
  pour Bottom: 0.23,88.53 109.61,88.53 109.61,88.17 109.45,88.17 109.45,0.35 0.23,0.35
I2C_A0
  Top 0.254: IC3.1 65.56,49.8 R51.2 R50.1
I2C_A1
  Top 0.254: IC3.2 72.94,51.15 72.94,53.97 R53.2 73.89,54.17 R52.1 75.4,54.17 75.48,54.08
I2C_A2
  Top 0.254: IC3.3 66.79,52.42 R54.1 R55.2
I2C_CA_0
  Top 0.203: R40.1 R41.2 62.5,76.47 62.5,75.36 63.06,74.8
  Top 0.254: 63.06,74.8 U$5.CA_0
I2C_CA_1
  Top 0.203: R43.2 R42.1 65.4,78.45 66.35,77.5 66.35,75.44 66.19,75.28 63.89,75.28 63.7,75.08
  Top 0.254: 63.7,75.08 U$5.CA_1
I2C_CA_2
  Top 0.203: 65.04,64.96 R44.1 63.73,65 | R45.2 63.73,65 | 63.73,65 63.7,65.04 64.37,65.71 64.37,67.78 64.21,67.93 63.81,67.93 63.7,68.05
  Top 0.254: 63.7,68.05 U$5.CA_2
MONITOR_M1_CH1  (via drill 0.6)
  Top 0.254: R13.1 R11.1 83.26,73.57 R10.1 | R13.1 83.26,71.19 R12.1 | R13.1 80.36,70 79.85,69.48 79.85,49.2 78.06,47.42 67.7,47.42 66.47,46.19 v66.47,41.38 | DD2.3 71.04,29.99 71.31,30.27 73.66,30.27 v74.05,29.87
  Bottom 0.254: v66.47,41.38 66.47,30.91 67.03,30.27 73.66,30.27 v74.05,29.87
MONITOR_M1_CH2  (via drill 0.6)
  Top 0.254: 80.32,63.29 80.32,48.96 77.98,46.66 69.09,46.66 67.98,45.55 v67.98,41.46 | DD2.4 70.39,28.64 70.4,28.66 70.4,30.55 70.68,30.83 v75.68,30.79
  Bottom 0.254: v67.98,41.46 66.91,40.39 66.91,31.78 67.78,30.83 v75.68,30.79
MONITOR_M2_CH1  (via drill 0.6)  (1 unrouted)
  Top 0.254: 80.8,57.85 80.8,48.61 78.26,46.07 70.16,46.07 69.41,45.31 v69.41,41.46 | DD2.5 69.73,31.11 70.36,31.74 v72.58,31.74 | R14.1 83.3,68.77 R15.1 R17.1 83.38,66.31 R16.1
  Bottom 0.254: v69.41,41.46 69.45,37.81 69.25,37.61 69.25,35.23 68.26,34.24 68.26,32.37 68.89,31.74 v72.58,31.74
MONITOR_M2_CH2  (via drill 0.6)
  Top 0.254: 81.91,54 82.23,53.68 82.23,49.24 78.5,45.51 70.88,45.51 70.64,45.27 v70.64,41.46 | DD2.6 69.08,31.42 70.16,32.57 76.16,32.57 v76.59,32.14
  Bottom 0.254: v70.64,41.46 70.64,37.85 71.79,36.7 71.79,33.84 73.06,32.61 74.41,32.57 76.16,32.57 v76.59,32.14
MONITOR_MAXON_1  (via drill 0.6)
  Top 0.254: v74.21,12.85 R64.2
  Bottom 0.254: v74.21,12.85 73.22,11.86 67.7,11.86 65.64,13.92 65.64,18.13 53.97,29.8 53.97,42.61 U$1.MONITOR_N
MONITOR_MAXON_2  (via drill 0.6)
  Top 0.254: R65.2 67.78,14.79 68.97,13.6 68.97,11.38 v69.57,10.78
  Bottom 0.254: v69.57,10.78 75.72,10.78 94.57,29.64 94.57,42.81 U$2.MONITOR_N
N$1
  Bottom 0.254: SV2.2 SV2.1
  Bottom 1.93: U$2.W1 U$2.W1_2 59.73,44.08 47.9,55.91 24.16,55.91 23.21,56.86 SV2.2 16.07,55.91 U$3.P$1
N$2
  Bottom 0.254: U$3.P$2 18.32,59.41 18.37,59.36 17.86,59.36 SV2.4 SV2.3
  Bottom 1.93: U$2.W2 U$2.W2_2 75.52,45.79 74.09,47.22 61.23,47.22 49.04,59.41 U$3.P$2
N$3  (1 unrouted)
  Bottom 1.93: U$2.W3 U$2.W3_2 78.06,47.77 75.16,50.67 62.58,50.67 50.34,62.91 24.34,62.91 23.37,61.94 SV2.6 12.71,61.94 U$3.P$3
N$4
  Top 1.93: U$1.VCC_2 U$1.VCC 39.8,39.28 39.29,38.76 36.43,38.76 35.04,37.38 35.04,29.28 F1.P$2
N$5
  Top 0.203: U$14.E_2 24.72,13.4 5.16,13.4 4.64,12.89 SHNT_I2.1
N$6
  Top 0.203: U$1.SETCURRENTLIMIT 36.02,79.61 R1.1
N$7  (via drill 0.6 pad 0.25)  (2 unrouted)
  Top 0.254: 85.68,52.42 85.68,45.67 86.59,44.76 86.59,43.17 U$2.H1
  Bottom 0.254: v85.6,52.34 83.74,52.34 80.56,55.51 64.49,55.51 47.9,72.1 SV2.13 19.52,72.14 15.47,72.14 13.87,73.74 13.87,75.72 12.68,76.91 U$3.P$7
N$8
  Bottom 0.203: 47.73,47.15 48.49,46.38 48.49,43.37 47.42,42.3 U$1.H1
  Bottom 0.254: 47.73,47.15 47.26,47.61 28.61,47.61 23.02,42.02 SV1.13 SV1.14 12.69,47.15 U$4.P$7
N$9  (via drill 0.6)
  Top 0.254: v87.11,50.83 87.11,43.25 87.39,42.97 89.33,42.97 U$2.H2
  Bottom 0.254: v87.11,50.83 84.29,50.83 80.6,54.52 64.25,54.52 49.21,69.56 SV2.11 SV2.12 15,69.56 13.65,70.91 13.65,71.98 12.22,73.41 U$3.P$6
N$10
  Bottom 0.254: U$2.H3 91.99,42.85 91.99,46.11 88.5,49.6 84.21,49.6 80.09,53.73 63.81,53.73 50.52,67.02 SV2.9 SV2.10 15.44,67.02 12.54,69.91 U$3.P$5
N$12
  Top 1.93: U$2.VCC_2 U$2.VCC 80.6,40.59 78.58,38.57 59.13,38.57 57.82,37.26 57.82,21.86 50.84,14.87 F2.P$2
N$13
  Top 0.254: U$2.SETCURRENTLIMIT 76.79,76.72 R4.1
N$15
  Bottom 0.203: U$1.H2 49.01,40.59 46.83,40.59 46.19,41.22 46.19,45.19 45.2,46.19
  Bottom 0.254: 45.2,46.19 30.44,46.19 23.73,39.48 SV1.11 SV1.12 16.78,39.48 12.62,43.65 U$4.P$6
N$16
  Bottom 0.203: 47.74,48.84 51.35,45.23 51.35,42.69 U$1.H3
  Bottom 0.254: 47.74,48.84 9.76,48.84 9.04,48.13 9.04,40.99 9.88,40.15 U$4.P$5 13.22,40.15 16.43,36.94 SV1.10 SV1.9
N$17
  Top 1.93: U$1.W1_2 32.18,42.06 | 32.18,42.06 U$1.W1 | U$1.W1 | 32.18,42.06 32.18,31.7 27.26,26.78 SV1.1 18.33,26.78 SV1.2 12.37,26.78 U$4.P$1 | 32.18,42.06
N$18
  Top 0.254: U$10.E_2 26.35,18.25 27.66,19.55 SHNT_I1.1
N$19
  Top 0.254: U$10.E_1 30.2,22.02 SHNT_I1.2
N$20
  Top 0.203: U$14.E_1 30.52,15.15 26.03,9.91 8.37,9.91 SHNT_I2.2
N$22  (via drill 0.6)
  Top 0.254: DD2.20 DD2.19 71.67,22.33 v71.67,24.36 | v84.02,22.97 84.02,21.62 83.86,21.46 R66.2 | C7.1 51.99,46.7 55.24,43.45 55.24,41.98 v55.28,41.94
  Bottom 0.254: v84.02,22.97 73.06,22.97 v71.67,24.36 66.95,24.36 56.43,34.88 56.43,36.7 55.28,37.85 v55.28,41.94
N$23  (via drill 0.6)
  Top 0.254: R63.1 R64.1 74.21,18.64 73.44,19.42 v73.42,19.44 71.03,21.82 DD2.18 | ENCODER.P$3 72.66,8.98 v72.66,13.17
  Bottom 0.254: v72.66,13.17 72.66,18.68 v73.42,19.44
N$24  (via drill 0.6)
  Top 0.254: R62.1 v72.03,19.64 70.39,21.28 DD2.17 | ENCODER.P$4 71,7.14 v71,13.29
  Bottom 0.254: v71,13.29 71,18.6 v72.03,19.64
N$25  (via drill 0.6)
  Top 0.254: DD2.16 69.73,21.43 v68.02,19.55 68.02,17.65 R65.1 R61.1 | ENCODER.P$5 v67.5,13.32
  Bottom 0.254: v67.5,13.32 67.5,19.2 v68.02,19.55
N$31
  Top 0.254: R5.1 87.58,77.73 U$2.DIGIN1
N$32
  Top 0.254: R60.1 65.64,18.4 67.05,19.77 | DD2.15 69.08,21.81 67.05,19.77 | ENCODER.P$6 62.54,8.6 62.54,19.36 62.88,19.69 67.05,19.77
N$33
  Top 1.93: U$1.W3 U$1.W3_2 37.26,47.85 35.28,49.84 29.52,49.84 26.51,46.82 26.51,34.76 23.61,31.86 SV1.5 SV1.6 14.17,31.86 12.88,33.15 U$4.P$3
N$34
  Top 0.254: R6.1 85.8,78.49 U$2.DIGIN2
N$36
  Top 0.254: 34.8,46.34 34.8,44.16 U$1.W2_2
  Top 1.676: 25.36,29.32 26.01,29.97
  Top 1.93: 25.69,29.65 26.01,29.97 29.33,33.29 29.33,45.55 30.71,46.94 34.21,46.94 34.8,46.34 34.8,41.62 U$1.W2 | 25.36,29.32 SV1.3 SV1.4 12.07,29.32 U$4.P$2
N$38
  Top 0.203: U$1.DIGIN1 49.57,79.64 51.31,77.9 R2.1
N$39
  Top 0.203: U$1.DIGIN2 46.99,79.64 47.94,78.69 R3.1
READY_M1  (via drill 0.6)
  Top 0.254: U$1.READY 53.38,81.78 TP7.TP | IC3.9 56.28,59.64 v54.65,61.27 | v50.24,65.75 v50.24,72.62
  Bottom 0.254: v54.65,61.27 54.65,61.35 v50.24,65.75 | v50.24,72.62 50.24,78.65 U$1.READY
READY_M2  (via drill 0.6)
  Top 0.254: TP8.TP 91.24,87.3 v92.07,86.47 | IC3.10 57.19,57.5 60.96,61.27 v60.96,61.31 | v63.66,63.17 65.28,63.17 v66.59,61.9 | v78.02,78.85 78.02,80.2 78.34,80.52 91.16,80.52 U$2.READY
  Bottom 0.254: v92.07,86.47 92.07,79.64 U$2.READY | v60.96,61.31 63.1,63.17 v63.66,63.17 | v66.59,61.9 67.66,61.9 73.02,67.26 73.02,69.96 78.02,74.96 v78.02,78.85
S_V_S_1  (via drill 0.5)
  Top 0.203: U$5.VOUT_A v61.79,66.74
  Top 0.254: v57.27,81.59 59.05,83.37 TP1.TP
  Bottom 0.203: 56.08,81.15 34.05,81.15 | 34.05,81.15 33.45,80.55 U$1.SETVALUESPEED | U$1.SETVALUESPEED | 56.08,81.15 57.23,80 57.23,68.49 59.01,66.7 v61.79,66.74 | 33.81,81.15 34.05,81.15 | v57.27,81.59 56.83,81.15 56.08,81.15
S_V_S_2  (via drill 0.5, 0.6)
  Top 0.203: U$5.VOUT_B 62.43,67.58 v63.14,67.58
  Top 0.254: TP2.TP v66.63,86.11
  Bottom 0.203: U$2.SETVALUESPEED 66.95,79.64 65.88,79.64 65.2,78.97 65.2,68.01 64.77,67.58 v63.14,67.58
  Bottom 0.254: v66.63,86.11 66.63,79.64 66.95,79.64
SCL  (via drill 0.5, 0.6)
  Top 0.203: v66.43,69.92 64.65,69.92 64.33,69.64 U$5.SCL
  Top 0.254: R33.1 76.51,21.58 U$6.DRAIN 72.66,24.56 70.92,26.3 67.07,26.3 v65.6,27.69 | IC3.14 54.37,52.42 53.34,53.45 53.34,66.39 v55.48,68.57 55.48,69.2 54.29,70.28 52.46,70.28 51.35,69.17 51.35,52.22 57.11,46.46 v57.11,41.94
  Bottom 0.254: v55.48,68.57 56,68.49 58.5,65.99 64.77,65.99 66.39,67.62 v66.43,69.92 | v57.11,41.94 57.11,36.26 v65.6,27.69
SDA  (via drill 0.5, 0.6)
  Top 0.203: U$5.SDA 64.33,73.25 64.61,72.97 v66.43,72.97 | R31.1 U$15.DRAIN
  Top 0.254: v68.18,70.51 68.5,70.83 U$15.DRAIN | IC3.15 54.49,51.15 52.5,53.13 52.5,68.21 v53.57,69.28
  Bottom 0.254: v66.43,72.97 66.43,72.26 v68.18,70.51 68.18,66.78 66.63,65.24 57.62,65.24 v53.57,69.28
V_HALL_1
  Top 0.254: U$1.VCC_HALL 44.88,41.62 43.73,42.81 41.83,42.81 41.07,43.49 41.07,47.93 37.5,51.54 16.23,51.54 15.33,50.65 U$4.P$8 SV1.16
  Bottom 0.254: SV1.15 SV1.16
V_HALL_2  (via drill 0.6)
  Top 0.254: v5.95,53.41 4.52,54.84 4.52,78.08 6.86,80.41 U$3.P$8
  Bottom 0.203: 58.59,42.55 51.35,49.8 25.71,49.8 | 13.69,53.41 v5.95,53.41
  Bottom 0.254: U$2.VCC_HALL 85.68,41.07 84.61,39.99 72.07,39.99 71.47,40.59 71.47,42.04 70.96,42.55 58.59,42.55 | SV2.15 SV2.16 14.8,76.87 14.8,79.38 13.77,80.41 U$3.P$8 | 25.71,49.8 17.3,49.8 13.69,53.41
VDC_1
  Top 1.93: U$10.I_1 35.79,18.56 F1.P$1
VDC_2
  Top 1.93: U$14.I_1 35.79,13.01 F2.P$1

### Text on the board
tNames: SCL1 | SDA1 | AREF | GND | PWM13 | PWM12 | PWM11 | PWM10 | PWM9 | PWM8 | PWM7 | PWM6 | PWM5 | PWM4 | PWM3 | PWM2 | TX0 | RX0 | TX3 | RX3 | TX2 | RX2 | TX1 | RX1 | SDA | SCL | 5V | 5V | D22 | D23 | S_V_S_1 | GND | ENABLE_1 | DIGIN_1 | S_V_S_2 | GND | ENABLE_2 | DIGIN1 | S_C_L_1 | DIRECTION_1 | DIGIN_2 | READY_1 | S_C_L_2 | DIRECTION_2 | DIGIN2 | READY_2 | D24 | D25 | D26 | D27 | D28 | D29 | D30 | D31 | D32 | D33 | D34 | D35 | D36 | D37 | D38 | D39 | Motor_Channel_2 | D40 | D41 | D42 | D43 | D44 | D45 | D46 | D47 | D48 | D49 | W1_2 | W2_2 | W3_2 | VCC_2 | GND | N.C. | GND | GND | Monitor_N_1 | W1_2 | W2_2 | W3_2 | VCC_2 | GND | N.C. | GND | GND | Monitor_N_2 | D50 | D51 | D52 | D53 | GND | GND | W1 | W2 | W3 | VCC | GND | VCC_H | H1 | H2 | H3 | W1 | W2 | W3 | VCC | GND | VCC_H | H1 | H2 | H3 | NOT USED | IOREF | RESET | 3V3 | 5V | GND | GND | VIN | A0 | A1 | A2 | A3 | A4 | A5 | A6 | A7 | A9 | A10 | A11 | DAC0 | DAC1 | CANRX | CANTX | A8 | Motor_Channel_1 | 6 - 50 VDC | GND
bNames: TP_GND